# EAGLE schematic feather-v2.0 (EAGLE 9.5.1)
COMPANY: ADAFRUIT INDUSTRIES; DRAWN: KTOWN; REV: B

## Sheet 1 of 2
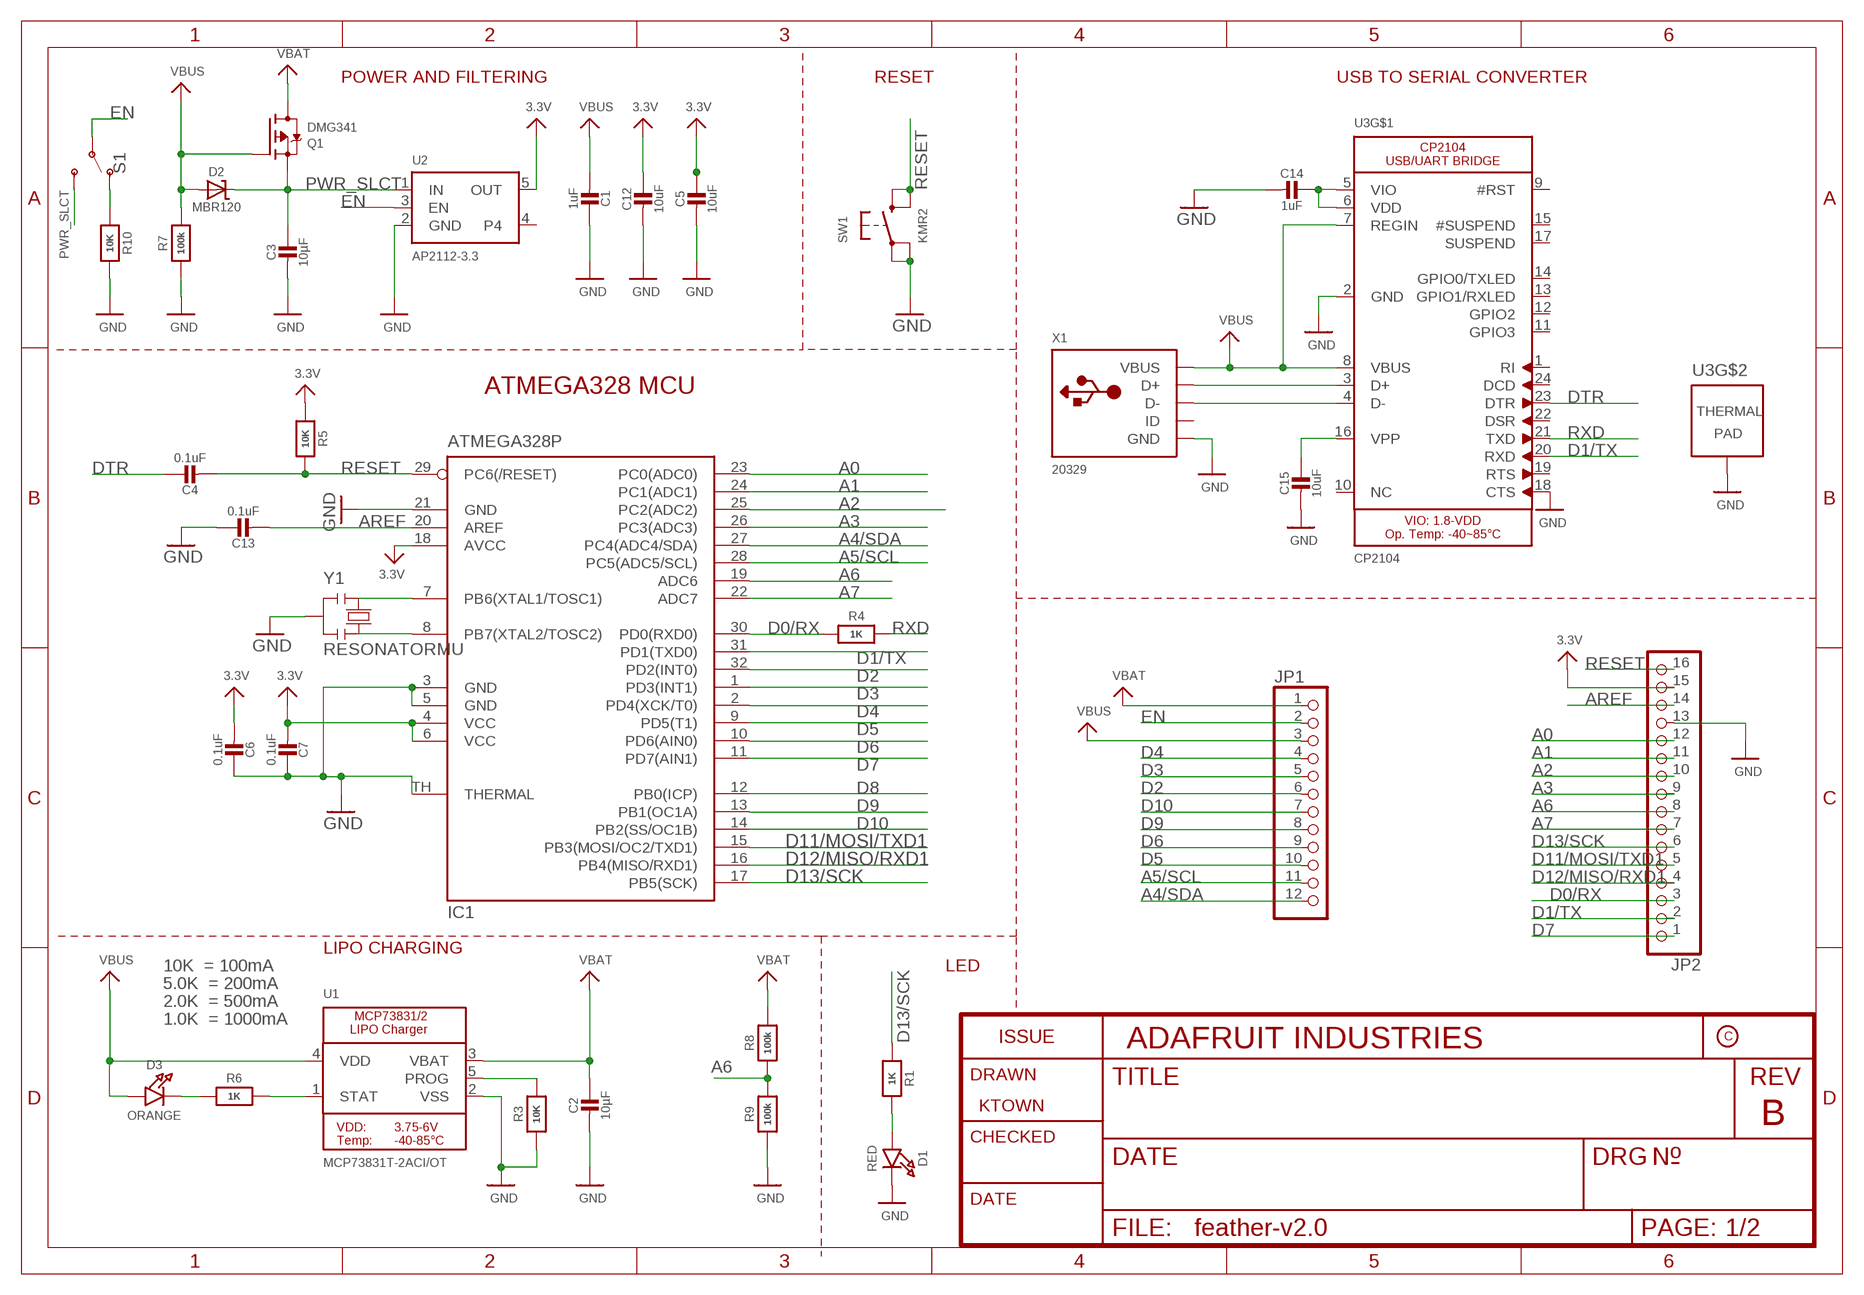
[diagram p0: schematic, sheet 1]

### Parts
C1  1uF  CAP_CERAMIC_0603MP  [_0603MP]
C2  10µF  CAP_CERAMIC_0603MP  [_0603MP]
C3  10µF  CAP_CERAMIC_0603MP  [_0603MP]
C4  0.1uF  CAP_CERAMIC_0603MP  [_0603MP]
C5  10uF  CAP_CERAMIC_0603MP  [_0603MP]
C6  0.1uF  CAP_CERAMIC_0603MP  [_0603MP]
C7  0.1uF  CAP_CERAMIC_0603MP  [_0603MP]
C12  10uF  CAP_CERAMIC_0603MP  [_0603MP]
C13  0.1uF  CAP_CERAMIC_0603MP  [_0603MP]
C14  1uF  CAP_CERAMIC_0603MP  [_0603MP]
C15  10uF  CAP_CERAMIC_0603MP  [_0603MP]
D1  RED  LED0603_NOOUTLINE  [CHIPLED_0603_NOOUTLINE]
D2  MBR120  DIODE-SCHOTTKYSOD-323  [SOD-323]
D3  ORANGE  LED0603_NOOUTLINE  [CHIPLED_0603_NOOUTLINE]
IC1  ATMEGA328P  MEGA8-MI  [MLF32-TH]
JP1  HEADER-1X12  [1X12_ROUND]
JP2  HEADER-1X16ROUND  [1X16_ROUND]
Q1  DMG341  MOSFET-P  [SOT23-R]
R1  1K  RESISTOR_0603MP  [_0603MP]
R3  10K  RESISTOR_0603MP  [_0603MP]
R4  1K  RESISTOR_0603MP  [_0603MP]
R5  10K  RESISTOR_0603MP  [_0603MP]
R6  1K  RESISTOR_0603MP  [_0603MP]
R7  100k  RESISTOR_0603MP  [_0603MP]
R8  100k  RESISTOR_0603MP  [_0603MP]
R9  100k  RESISTOR_0603MP  [_0603MP]
R10  10K  RESISTOR_0603MP  [_0603MP]
S1  SWITCH-SPDT-SMD-RIGHT-ANGLE  [SWITCH_SPST_SMD_A]
SW1  KMR2  SWITCH_TACT_SMT4.6X2.8  [BTN_KMR2_4.6X2.8]
U1  MCP73831T-2ACI/OT  MCP73831/2  [SOT23-5]
U2  AP2112-3.3  VREG_SOT23-5  [SOT23-5]
U3  CP2104  [QFN24_4MM_SMSC]
X1  20329  USB_MICRO_20329_V2  [4UCONN_20329_V2]
Y1  RESONATORMU  [RESONATOR]

### Nets
3.3V: C5.1 C6.2 C7.2 C12.1 IC1.4(VCC) IC1.6(VCC) IC1.18(AVCC) JP2.15 R5.2 U2.5(OUT) ; also sheet 2
A0: IC1.23(PC0(ADC0)) JP2.12 ; also sheet 2
A1: IC1.24(PC1(ADC1)) JP2.11 ; also sheet 2
A2: IC1.25(PC2(ADC2)) JP2.10 ; also sheet 2
A3: IC1.26(PC3(ADC3)) JP2.9 ; also sheet 2
A4/SDA: IC1.27(PC4(ADC4/SDA)) JP1.12 ; also sheet 2
A5/SCL: IC1.28(PC5(ADC5/SCL)) JP1.11 ; also sheet 2
A6: IC1.19(ADC6) JP2.8 R8.1 R9.2
A7: IC1.22(ADC7) JP2.7 ; also sheet 2
AREF [aref]: C13.2 IC1.20(AREF) JP2.14
D0/RX: IC1.30(PD0(RXD0)) JP2.3 R4.1
D1/TX: IC1.31(PD1(TXD0)) JP2.2 U3.20(RXD)
D2: IC1.32(PD2(INT0)) JP1.6
D3: IC1.1(PD3(INT1)) JP1.5
D4: IC1.2(PD4(XCK/T0)) JP1.4
D5: IC1.9(PD5(T1)) JP1.10
D6: IC1.10(PD6(AIN0)) JP1.9
D7: IC1.11(PD7(AIN1)) JP2.1 ; also sheet 2
D8: IC1.12(PB0(ICP))
D9: IC1.13(PB1(OC1A)) JP1.8 ; also sheet 2
D10: IC1.14(PB2(SS/OC1B)) JP1.7 ; also sheet 2
D11/MOSI/TXD1: IC1.15(PB3(MOSI/OC2/TXD1)) JP2.5 ; also sheet 2
D12/MISO/RXD1: IC1.16(PB4(MISO/RXD1)) JP2.4 ; also sheet 2
D13/SCK: IC1.17(PB5(SCK)) JP2.6 R1.1
DTR: C4.1 U3.23(DTR)
EN: JP1.2 S1.2(P) U2.3(EN)
GND: C1.1 C2.2 C3.2 C5.2 C6.1 C7.1 C12.2 C13.1 C14.2 C15.2 D1.C IC1.3(GND) IC1.5(GND) IC1.21(GND) IC1.TH(THERMAL) JP2.13 R3.1 R7.1 R9.1 R10.1 SW1.A'(P1) SW1.A(P) U1.2(VSS) U2.2(GND) U3.2(GND) U3.18(CTS) U3.THERM(TP) X1.BASE@1(GND) X1.BASE@2(GND) X1.GND X1.SPRT@1(GND) X1.SPRT@2(GND) X1.SPRT@3(GND) X1.SPRT@4(GND) Y1.2 ; also sheet 2
N$1: D3.C R6.1
N$2: U3.3(D+) X1.D+
N$3: R6.2 U1.1(STAT)
N$4: R3.2 U1.5(PROG)
N$5: D1.A R1.2
N$6: U3.4(D-) X1.D-
N$7: R10.2 S1.1(O)
N$9: IC1.8(PB7(XTAL2/TOSC2)) Y1.3
N$10: C14.1 U3.5(VIO) U3.6(VDD)
N$17: IC1.7(PB6(XTAL1/TOSC1)) Y1.1
N$41: C15.1 U3.16(VPP)
PWR_SLCT: C3.1 D2.C Q1.2(S) S1.3(S) U2.1(IN)
RESET: C4.2 IC1.29(PC6(/RESET)) JP2.16 R5.1 SW1.B'(S1) SW1.B(S)
RXD: R4.2 U3.21(TXD)
VBAT: C2.1 JP1.1 Q1.3(D) R8.2 U1.3(VBAT) ; also sheet 2
VBUS: C1.2 D2.A D3.A JP1.3 Q1.1(G) R7.2 U1.4(VDD) U3.7(REGIN) U3.8(VBUS) X1.VBUS
Unconnected: U2.4 U3.1(RI) U3.9(#RST) U3.10(NC) U3.11(GPIO3) U3.12(GPIO2) U3.13(GPIO1/RXLED) U3.14(GPIO0/TXLED) U3.15(#SUSPEND) U3.17(SUSPEND) U3.19(RTS) U3.22(DSR) U3.24(DCD) X1.ID

### Notes on the sheet
- POWER AND FILTERING | RESET | USB TO SERIAL CONVERTER
- ATMEGA328 MCU
- LIPO CHARGING
- 10K  = 100mA | LED
- 5.0K  = 200mA
- 2.0K  = 500mA
- 1.0K  = 1000mA

## Sheet 2 of 2
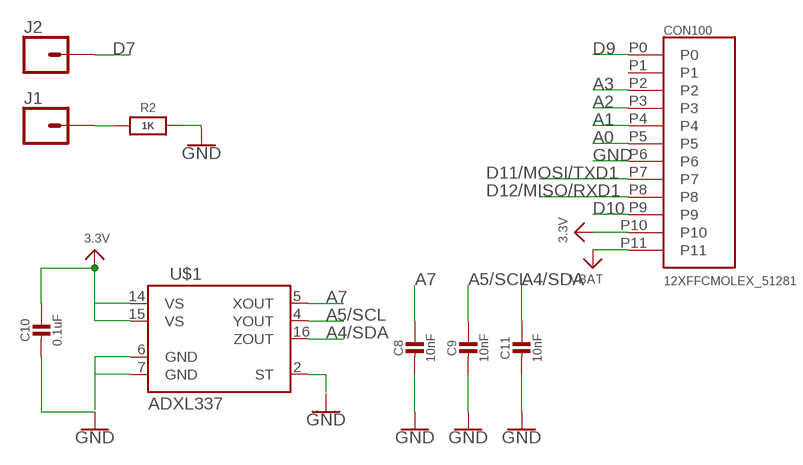
[diagram p1: schematic, sheet 2]

### Parts
C8  10nF  CAP_CERAMIC_0603MP  [_0603MP]
C9  10nF  CAP_CERAMIC_0603MP  [_0603MP]
C10  0.1uF  CAP_CERAMIC_0603MP  [_0603MP]
C11  10nF  CAP_CERAMIC_0603MP  [_0603MP]
CON100  12XFFCMOLEX_51281  [MOLEX_51281-1294]
J1  CONN_01PTH_NO_SILK_YES_STOP  [1X01_NO_SILK]
J2  CONN_01PTH_NO_SILK_YES_STOP  [1X01_NO_SILK]
R2  1K  RESISTOR_0603MP  [_0603MP]
U$1  ADXL337  [LFCSP_LQ-16]

### Nets
3.3V: C10.1 CON100.P10 U$1.15(VS) ; also sheet 1
A0: CON100.P5 ; also sheet 1
A1: CON100.P4 ; also sheet 1
A2: CON100.P3 ; also sheet 1
A3: CON100.P2 ; also sheet 1
A4/SDA: C11.1 U$1.16(ZOUT) ; also sheet 1
A5/SCL: C9.1 U$1.4(YOUT) ; also sheet 1
A7: C8.1 U$1.5(XOUT) ; also sheet 1
D7: J2.1 ; also sheet 1
D9: CON100.P0 ; also sheet 1
D10: CON100.P9 ; also sheet 1
D11/MOSI/TXD1: CON100.P7 ; also sheet 1
D12/MISO/RXD1: CON100.P8 ; also sheet 1
GND: C8.2 C9.2 C10.2 C11.2 CON100.P6 R2.2 ; also sheet 1
N$12: J1.1 R2.1
N$13: U$1.14(VS)
N$14: U$1.7(GND)
N$15: U$1.6(GND)
N$16: U$1.2(ST)
VBAT: CON100.P11 ; also sheet 1
Unconnected: CON100.P1

## Library data of the parts
C1-C15 = NU-Smarticle v2:CAP_CERAMIC: Ceramic Capacitors For new designs, use the packages preceded by an '_' character since they are more reliable: The following footprints should be used on most boards: _0402 - Standard footprint for regular board layouts _0603 - Standard footprint for regular board layouts _0805 - Standard footprint for regular board layouts _1206 - Standard footprint for regular board layouts For extremely tight-pitch boards where space is at a premium, the following 'micro-pitch' footprints can be used (smaller pads, no silkscreen outline, etc.): _0402MP - Micro-pitch footprint for very dense/compact boards _0603MP - Micro-pitch footprint for very dense/compact boards _0805MP - Micro-pitch footprint for very dense/compact boards _1206MP - Micro-pitch footprint for very dense/compact boards
CON100 = NU-Smarticle v2:12XFFC
D1 D3 = NU-Smarticle v2:LED: LED 0603 - 0603 Surface Mount Package 2mA: Green LED - Low Power (3.9mcd, 2ma, 1.7Vf) - Digikey: 475-2709-2-ND Orange LED - Low Power (9.8mcd, 2ma, 1.8Vf) - Digikey: 475-1194-2-ND Red LED - Low Power (5mcd, 2ma, 1.8Vf) - Digikey: 475-1195-2-ND Yellow LED - Low Power (7mcd, 2ma, 1.8Vf) - Digikey: 475-1196-2-ND 5mA: Blue LED - Low Power (17mcd, 5ma, 2.9Vf) - Digikey: LNJ937W8CRACT-ND 0805 - 0805 Surface Mount Package 2mA: Red LED (8.8mcd, 2mA, 1.8Vf, Clear) - Low Power [Digikey: 475-2510-1-ND] Green LED (5mcd, 2mA, 1.8Vf, Clear) - Low Power [Digikey: 475-2730-1-ND] Yellow LED (11.3mcd, 2mA, 1.8Vf, Clear) - Low Power [Digikey: 475-2555-1-ND] 20mA: Red LED (104mcd, 20mA, Diffused) - LS R976 [Digikey: 475-1278-6-ND] Red LED (12mcd, 20mA, 2.0Vf, Clear) - APT2012EC [Digikey: 754-1128-1-ND] Green LED (15mcd, 20mA, 2.2Vf, Clear) - APT2012GC [Digikey: 754-1131-1-ND] Orange LED (160mcd, 20mA, 2.1Vf, Clear) - APT2012SECK [Digikey: 754-1130-1-ND] 1206 - 1206 Surface Mount Package Green LED (26mcd, 20mA, Diffused) - LG N971 [Digikey: 475-1407-6-ND] Red LED (15mcd, 20mA, Diffused) - LH N974 [Digikey: 475-1416-6-ND] Cree - Cree High-Power Surface Mount LEDs XPEBWT-L1-0000-00D50 - White 111lm 350mA 2.9Vf 6200K 110° XTEAWT-00-0000-00000LEE3 - White 114lm 350mA 2.85Vf 5000K 115° Everlight - Everlight 45-21 Series Surface Mount LEDs 45-21/QK2C-B2832AC2CB2/2T - Warm White 2000mcd 20mA 3.25Vf 3050K 120° 45-21/LK2C-B38452C4CB2/2T - Nuetral White 2000mcd 20mA 3.25Vf 4150K 120° 45-21/LK2C-B50634C6CB2/2T - Cold White 2200mcd 20mA 3.25Vf 5650K 120° PLCC2 Reverse Mount LS T77K-J1L2-1-0-2-R18-Z - Red 11.25mcd 2mA 1.8Vf 630nm 120° LO T77K-L1M2-24-Z - Orange 19.6mcd 2mA 1.8Vf 606nm 120° LY T77K-K2M1-26-Z - Yellow 15.7mcd 2mA 1.8Vf 587nm 120°
D2 = NU-Smarticle v2:DIODE-SCHOTTKY
IC1 = NU-Smarticle v2:MEGA8-MI: MICROCONTROLLER 8 Kbytes FLASH, 1 kbytes SRAM, 512 bytes EEPROM, USART, 6-channel 10 bit ADC, 2-channel 8 bit ADC Pin compatible with Atmega48, ATMega88, ATMega168 Source: avr.lbr; MPN: ATMEGA88PA-MU; OC_FARNELL: 1715491; OC_NEWARK: 15R0272
J1 J2 = NU-Smarticle v2:CONN_01: Single connection point. Often used as Generic Header-pin footprint for 0.1 inch spaced/style header connections On any of the 0.1 inch spaced packages, you can populate with these: Break Away Headers - Straight <https://www.sparkfun.com/products/116> (PRT-00116) Break Away Male Headers - Right Angle <https://www.sparkfun.com/products/553> (PRT-00553) Female Headers <https://www.sparkfun.com/products/115> (PRT-00115) Break Away Headers - Machine Pin <https://www.sparkfun.com/products/117> (PRT-00117) Break Away Female Headers - Swiss Machine Pin <https://www.sparkfun.com/products/743> (PRT-00743) This device is also useful as a general connection point to wire up your design to another part of your project. Our various solder wires solder well into these plated through hole pads. Hook-Up Wire - Assortment (Stranded, 22 AWG) <https://www.sparkfun.com/products/11375> (PRT-11375) Hook-Up Wire - Assortment (Solid Core, 22 AWG) <https://www.sparkfun.com/products/11367> (PRT-11367) View the entire wire category on our website here <https://www.sparkfun.com/categories/141> Special notes: SMTSO-256-ET is a "flush mount" nut for a 4-40 screw. We mostly use this on specialty testbeds; it is a nice way to connect hardware to your PCB at an adjustable hieght. Also note, the SNAP packages are for using a snappable style connector. We sell a baggie of snaps and they are also used on two LilyPad designs: Snap Assortment - 30 pack (male and female) <https://www.sparkfun.com/products/11347> (DEV-11347) LilyPad Arduino SimpleSnap <https://www.sparkfun.com/products/10941> (DEV-10941) LilyPad SimpleSnap Protoboard <https://www.sparkfun.com/products/10940> (DEV-10940)
JP1 = NU-Smarticle v2:HEADER-1X12
JP2 = NU-Smarticle v2:HEADER-1X16: PIN HEADER
Q1 = NU-Smarticle v2:MOSFET-P: P-Channel Mosfet LEGEND VDS: Voltage Drain-Source ID: Drain Current RDS(ON): Drain-Source On-State Resistance VGS(TH): Gate-Source Threshold Voltage CISS: Drain-Source Input Capacitance SOT-23 Name VDS ID RDS(ON) VGS(TH) CISS Order Number IRLML5103 30V 760mA 600 mOhm -- 75pF @ 25V Digikey: IRLML5103PBFCT-ND IRLML6401 12V 4.3A 50 mOhm 950mV @ 250µA 830pF @ 10V Digikey: IRLML6401PBFTR-ND NTR0202PL 20V 400mA 800 mOhm 2.3V @ 250uA 70pF @ 5V Digikey: NTR0202PLT1GOSTR-ND NTR4101PT1G 20V 1.8A 85 mOhm 1.2V @ 250uA 675pF @ 10V Digikey: NTR4101PT1GOSCT-ND DMP2004K 20V 600mA 900 mOhm 1V @ 250uA 175pF @ 16V Digikey: DMP2004KDICT-ND PMV65XP 20V 3.9A 76 mOhm 950mV @ 1mA 725pF @ 20V Digikey: 568-2358-2-ND TO-252 Name VDS ID RDS(ON) VGS(TH) CISS Order Number AOD417 30V 25A 34 mOhm 3V @ 250µA 920pF @ 15V Digikey: 785-1106-2-ND PowerPak Name VDS ID RDS(ON) VGS(TH) CISS Order Number AON7401 30V 12A 14 mOhm 3V @ 250µA 2600pF @ 15V Digikey: 785-1302-1-ND
R1-R10 = NU-Smarticle v2:RESISTOR: Resistors For new designs, use the packages preceded by an '_' character since they are more reliable: The following footprints should be used on most boards: _0402 - Standard footprint for regular board layouts _0603 - Standard footprint for regular board layouts _0805 - Standard footprint for regular board layouts _1206 - Standard footprint for regular board layouts For extremely tight-pitch boards where space is at a premium, the following 'micro-pitch' footprints can be used (smaller pads, no silkscreen outline, etc.): _0402MP - Micro-pitch footprint for very dense/compact boards _0603MP - Micro-pitch footprint for very dense/compact boards _0805MP - Micro-pitch footprint for very dense/compact boards _1206MP - Micro-pitch footprint for very dense/compact boards
S1 = NU-Smarticle v2:SWITCH-SPDT: Single Pole, Double Throw (SPDT) Switch Single-pole, double-throw (SPDT) switch. Variant Overview SMD-AYZ0202 Surface Mount DPDT Switch <https://www.sparkfun.com/products/597> (COM-00597) Used on e.g. LilyPad Arduino USB - ATmega32U4 Board <https://www.sparkfun.com/products/12049> PTH-11.6X4.0MM SPDT Mini Power Switch <https://www.sparkfun.com/products/102> (COM-00102) Used on e.g. SparkFun Simon Says - Through-Hole Soldering Kit <https://www.sparkfun.com/products/10547> (KIT-10547) PTH-11.6X4.0MM-KIT KIT version of SPDT Mini Power Switch - Simplifies soldering by removing tStop of switch pins - only one side can be soldered. PTH-11.6X4.0MM-LOCK LOCK version of SPDT Mini Power Switch - Offset pins hold switch in place for easier soldering. SMD-RIGHT-ANGLE Surface Mount Right Angle Switch <https://www.sparkfun.com/products/10860> (COM-10860) Used on e.g. SparkFun ESP8266 Thing <https://www.sparkfun.com/products/13231>; PROD_ID: SWCH-10651; SF_SKU: COM-10860
SW1 = NU-Smarticle v2:SWITCH_TACT_SMT: SMT Tact Switches 6x6mm - Digikey: P12940SCT-ND KMR2 (4.6x2.8mm) - Digikey: 401-1426-1-ND EVQ-PQHB55 - Light Touch, 160GF (4.5x4.5mm) - Digikey: P8090SCT-ND KMT0 - KMT021 NGJ LHS (etc.) IP68/Waterproof - Digikey: CKN10289CT-ND
U1 = NU-Smarticle v2:MCP73831/2: MCP73831/2 LIPO Charger VDD: 3.75 - 6V Temp -40 - 85°C Programmable Charge Rate: 15-500mA NOTE: STAT is a tri-state logic output on the MCP73831 and an open-drain output on the MCP73832. SOT23-5 with 4.2V output and tri-state logic on STAT = MCP73831T-2ACI/OT
U2 = NU-Smarticle v2:VREG_SOT23-5: SOT23-5 Fixed Voltage Regulators Part Current Out V Out V In V Dropout θJA (°C/W) TJ (°C) Digikey Part No. ADP121 150mA 3.3V 3.4-5.5V 0.09V @ 150mA -- -- ADP121-AUJZ33R7CT-ND ADP121 150mA 3.0V 3.1-5.5V 0.09V @ 150mA -- -- ADP121-AUJZ30R7CT-ND ADP122 300mA 3.3V 3.4-5.5V 0.085V @ 300mA -- -- ADP122AUJZ-3.3-R7CT-ND ADP1712 300mA 3.3V 3.5-5.5V 0.17V @ 300mA -- -- ADP1712AUJZ-3.3-R7TR-ND AP7311 (Low Cost) 150mA 3.3V 3.5-6V 0.15V @ 150mA -- -- AP7311-33WG-7DICT-ND LD39015M18R 150mA 1.8V 1.9V-5.5V 0.08V @ 100mA -- -- 497-6977-1-ND LP2985A-33DBVR 150mA 3.3V 3.3-16V 0.28V @ 150mA 206 150 296-18479-1-ND MCP1824T-3302E/OT 300mA 3.3V 3.5V-6V 0.2V @ 300mA -- -- MCP1824T-3302E/OTCT-ND MIC5205-2.5YM5 TR 150mA 2.5V 2.7-16V 0.165V @ 150mA -- -- 576-1257-2-ND MIC5205-3.0YM5 TR 150mA 3.0V 3.2V-16V 0.165V @ 150mA -- -- 576-1258-2-ND MIC5205-3.3YM5 TR 150mA 3.3V 3.5V-16V 0.165V @ 150mA -- -- 576-1259-2-ND TPS780330220 150mA 3.3V+2.2V 3.6-5.5V 250mV Max -- -- 296-23332-1-ND TDA3663/N1,135 100mA 3.3V 3.5-45V 0.18V @ 50mA -- -- 568-5343-1-ND Max operating temp can be calculated using θJA, TJ (max junction temperature), and power in watts. Set the "Maximum Ambient Temperature" until it reaches TJ ("Max Junction Temperature"), which is the absolute limit for safe use of the regulator: Heat Sink Temperature Calculator <http://www.daycounter.com/Calculators/Heat-Sink-Temperature-Calculator.phtml> For example, With 12V source into a 3.3V LP2985 and a 30mA load, we are dissipating (12V-3.3V) * 0.03A = 0.261W. With a θJA of 206 °C/W, a TJ of 150°C, and 261mW we can safely use the chip without a heat sink up to 75°C (=147.1°C Junction Temperature).
U3 = NU-Smarticle v2:CP2104: CP2104 - USB to UART Bridge VDD Output: 3.45V
U$1 = NU-Smarticle v2:ADXL337: ADXL337 Low Power 3-Axis ±3 g Accelerometer with Analog Output.
X1 = NU-Smarticle v2:USB: USB Connectors USBMINIB - Surface Mount Female Mini-B USB Connector 4UConnector: 06564
Y1 = NU-Smarticle v2:RESONATOR

## Net classes
1 power: width 0.305 mm, drill 0.483 mm, clearance 0.203 mm
2 gnd: width 0.305 mm, drill 0.483 mm, clearance 0.203 mm
3 usbvcc: width 0.305 mm, drill 0.483 mm, clearance 0.203 mm
4 aref: width 0.254 mm, drill 0.483 mm, clearance 0.203 mm